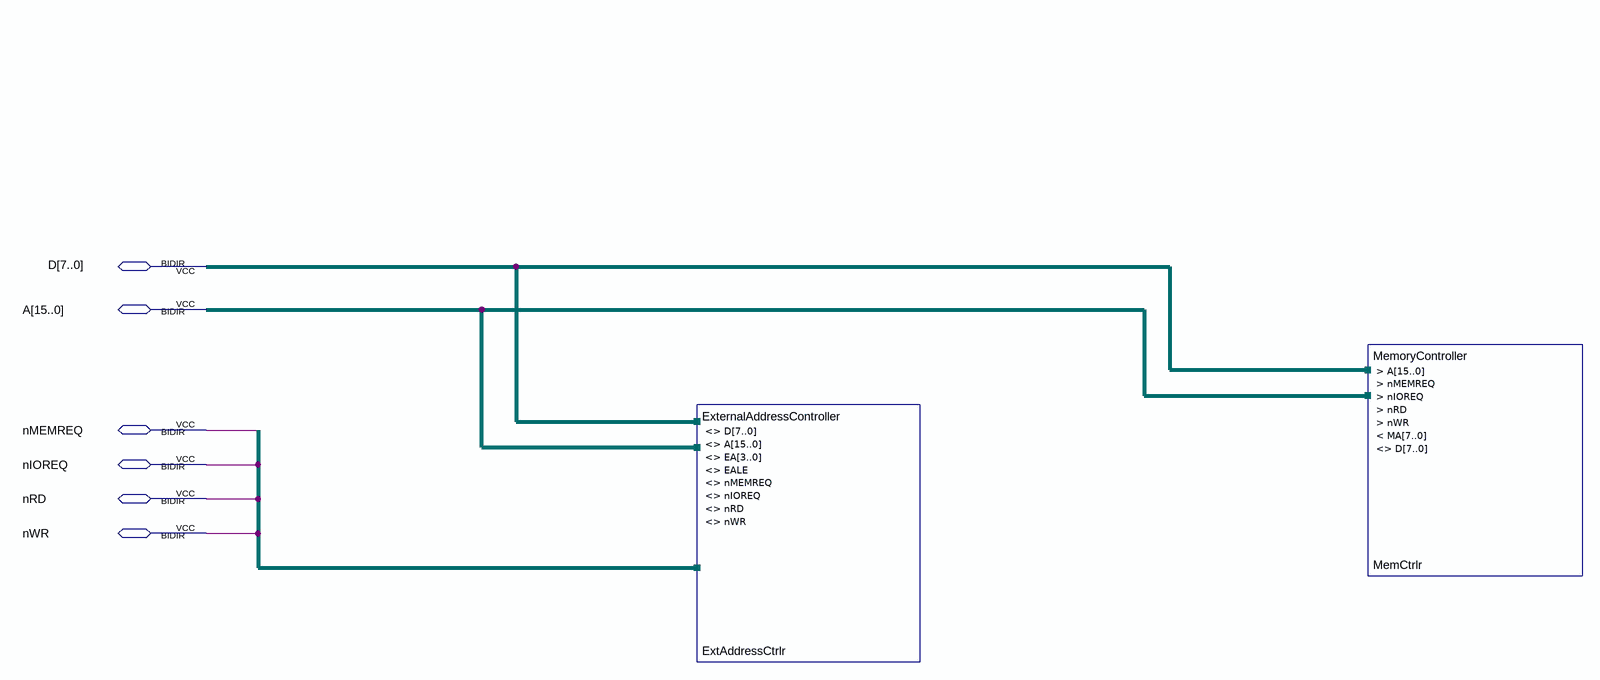
[diagram p0: schematic sheet]
// Quartus schematic SystemLogic.bdf as structural Verilog: 2 symbols, 6 pins
module SystemLogic (
  inout  [7:0] D,
  inout  [15:0] A,
  inout  nMEMREQ,
  inout  nIOREQ,
  inout  nRD,
  inout  nWR
);

  ExternalAddressController ExtAddressCtrlr (.D(D), .A(A), .nMEMREQ(nMEMREQ));  // open: EA, EALE, nIOREQ, nRD, nWR
  MemoryController MemCtrlr (.A(A), .nMEMREQ(nMEMREQ), .nIOREQ(nIOREQ), .nRD(nRD), .nWR(nWR), .D(D));  // open: MA
endmodule
